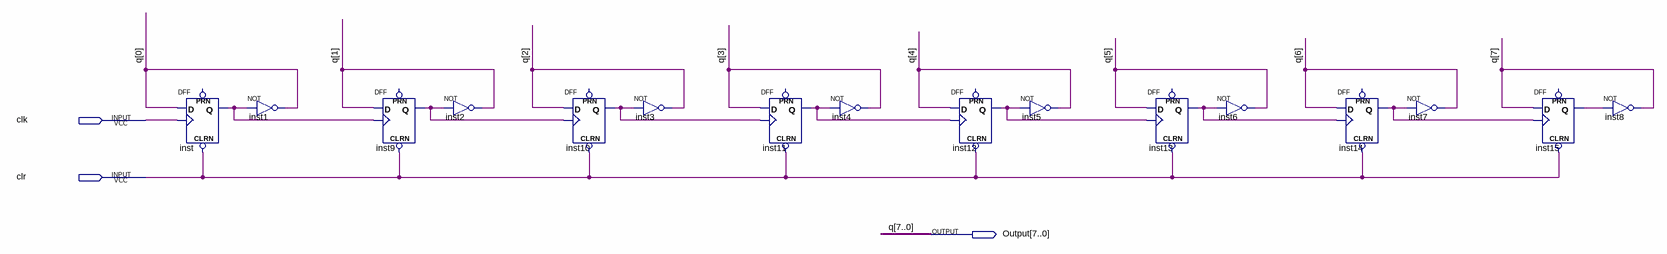
[diagram p0: schematic sheet]
// Quartus schematic SevenSeg.bdf as structural Verilog: 16 symbols, 3 pins
module SevenSeg (
  input  clk,
  input  clr,
  output [7:0] Output
);

  wire inst9_q, inst10_q, inst11_q, inst12_q, inst13_q, inst14_q, inst15_q, inst_q;

  DFF inst (.CLRN(clr), .CLK(clk), .D(Output[0]), .Q(inst_q));  // open: PRN
  not inst1 (Output[0], inst_q);
  DFF inst9 (.CLRN(clr), .CLK(inst_q), .D(Output[1]), .Q(inst9_q));  // open: PRN
  not inst2 (Output[1], inst9_q);
  DFF inst10 (.CLRN(clr), .CLK(inst9_q), .D(Output[2]), .Q(inst10_q));  // open: PRN
  not inst3 (Output[2], inst10_q);
  DFF inst11 (.CLRN(clr), .CLK(inst10_q), .D(Output[3]), .Q(inst11_q));  // open: PRN
  not inst4 (Output[3], inst11_q);
  DFF inst12 (.CLRN(clr), .CLK(inst11_q), .D(Output[4]), .Q(inst12_q));  // open: PRN
  not inst5 (Output[4], inst12_q);
  DFF inst13 (.CLRN(clr), .CLK(inst12_q), .D(Output[5]), .Q(inst13_q));  // open: PRN
  not inst6 (Output[5], inst13_q);
  DFF inst14 (.CLRN(clr), .CLK(inst13_q), .D(Output[6]), .Q(inst14_q));  // open: PRN
  not inst7 (Output[6], inst14_q);
  DFF inst15 (.CLRN(clr), .CLK(inst14_q), .D(Output[7]), .Q(inst15_q));  // open: PRN
  not inst8 (Output[7], inst15_q);

  // Other names for the same wires on the sheet: q[7:0] = Output
endmodule
